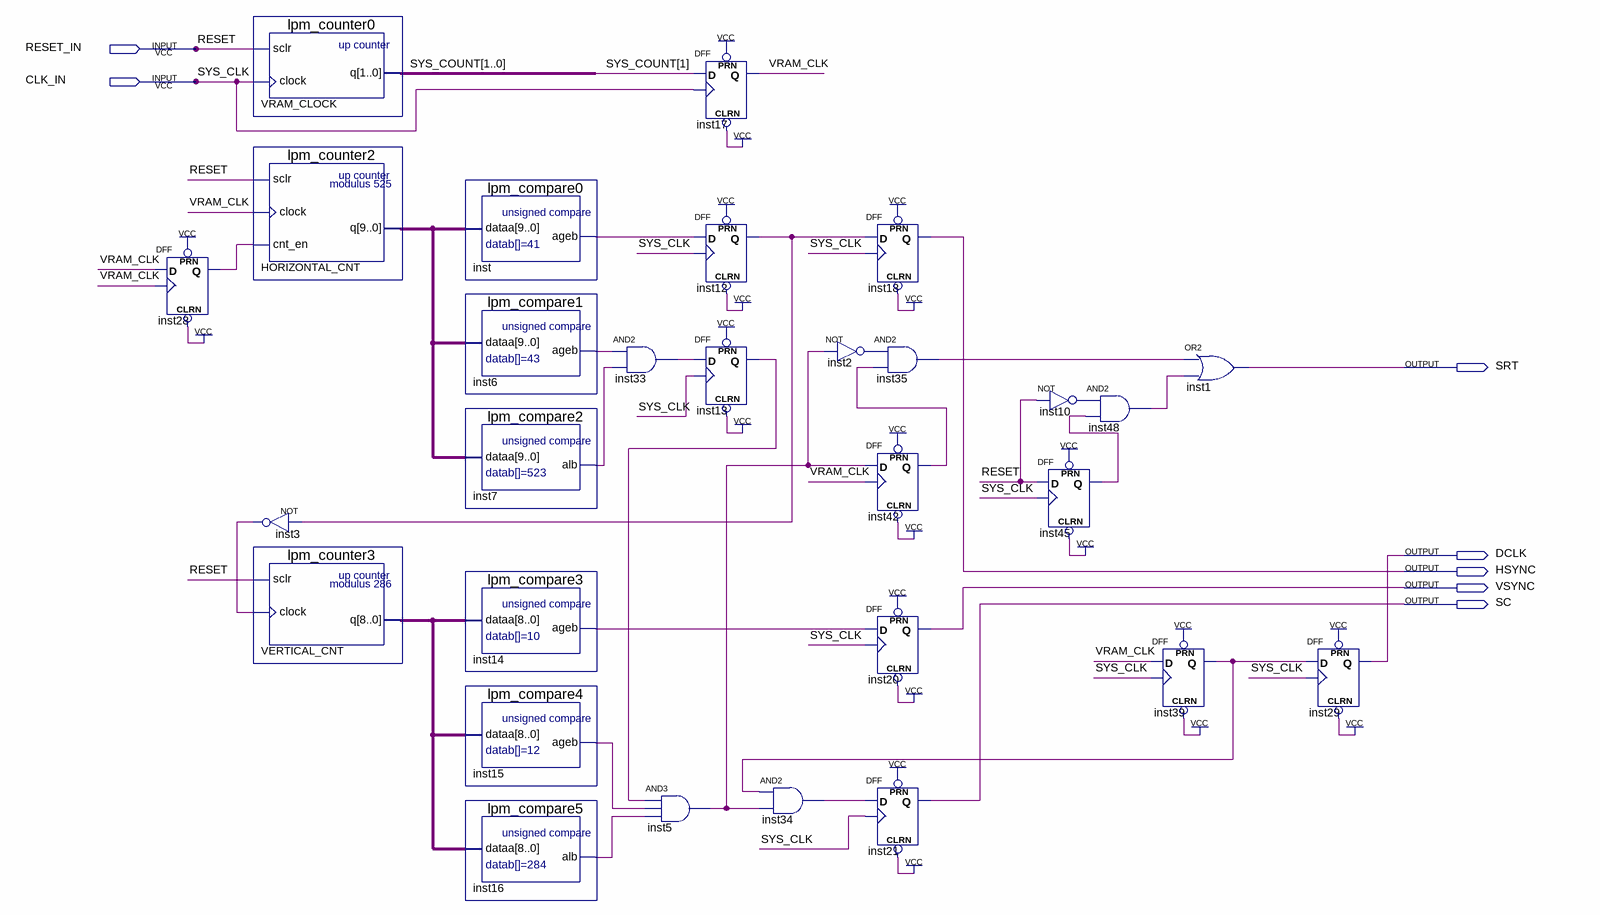
[diagram p0: schematic sheet]
// Quartus schematic oscilloscope-display-test.bdf as structural Verilog: 29 symbols, 7 pins
module \oscilloscope-display-test  (
  input  RESET_IN,
  input  CLK_IN,
  output SRT,
  output DCLK,
  output HSYNC,
  output VSYNC,
  output SC
);

  wire inst2_out, inst3_out, inst5_out, inst6_ageb, inst7_alb, inst10_out, inst12_q, inst13_q, inst14_ageb,
       inst15_ageb, inst16_alb, inst28_q, inst33_out, inst34_out, inst35_out, inst39_q, inst42_q, inst45_q,
       inst48_out, inst_ageb, VRAM_CLK;
  wire [1:0] SYS_COUNT;
  wire [8:0] VERTICAL_CNT_q;
  wire [9:0] HORIZONTAL_CNT_q;

  DFF inst28 (.CLRN(1'b1), .CLK(VRAM_CLK), .D(VRAM_CLK), .PRN(1'b1), .Q(inst28_q));
  lpm_counter0 VRAM_CLOCK (.sclr(RESET_IN), .clock(CLK_IN), .q(SYS_COUNT));
  lpm_counter2 HORIZONTAL_CNT (.sclr(RESET_IN), .clock(VRAM_CLK), .cnt_en(inst28_q), .q(HORIZONTAL_CNT_q));
  not inst3 (inst3_out, inst12_q);
  lpm_counter3 VERTICAL_CNT (.sclr(RESET_IN), .clock(inst3_out), .q(VERTICAL_CNT_q));
  lpm_compare0 inst (.dataa(HORIZONTAL_CNT_q), .ageb(inst_ageb));
  lpm_compare1 inst6 (.dataa(HORIZONTAL_CNT_q), .ageb(inst6_ageb));
  lpm_compare2 inst7 (.dataa(HORIZONTAL_CNT_q), .alb(inst7_alb));
  lpm_compare3 inst14 (.dataa(VERTICAL_CNT_q), .ageb(inst14_ageb));
  lpm_compare4 inst15 (.dataa(VERTICAL_CNT_q), .ageb(inst15_ageb));
  lpm_compare5 inst16 (.dataa(VERTICAL_CNT_q), .alb(inst16_alb));
  and inst33 (inst33_out, inst6_ageb, inst7_alb);
  and inst5 (inst5_out, inst13_q, inst15_ageb, inst16_alb);
  DFF inst17 (.CLRN(1'b1), .CLK(CLK_IN), .D(SYS_COUNT[1]), .PRN(1'b1), .Q(VRAM_CLK));
  DFF inst12 (.CLRN(1'b1), .CLK(CLK_IN), .D(inst_ageb), .PRN(1'b1), .Q(inst12_q));
  DFF inst13 (.CLRN(1'b1), .CLK(CLK_IN), .D(inst33_out), .PRN(1'b1), .Q(inst13_q));
  and inst34 (inst34_out, inst39_q, inst5_out);
  not inst2 (inst2_out, inst5_out);
  DFF inst18 (.CLRN(1'b1), .CLK(CLK_IN), .D(inst12_q), .PRN(1'b1), .Q(HSYNC));
  and inst35 (inst35_out, inst2_out, inst42_q);
  DFF inst42 (.CLRN(1'b1), .CLK(VRAM_CLK), .D(inst5_out), .PRN(1'b1), .Q(inst42_q));
  DFF inst20 (.CLRN(1'b1), .CLK(CLK_IN), .D(inst14_ageb), .PRN(1'b1), .Q(VSYNC));
  DFF inst21 (.CLRN(1'b1), .CLK(CLK_IN), .D(inst34_out), .PRN(1'b1), .Q(SC));
  not inst10 (inst10_out, RESET_IN);
  DFF inst45 (.CLRN(1'b1), .CLK(CLK_IN), .D(RESET_IN), .PRN(1'b1), .Q(inst45_q));
  and inst48 (inst48_out, inst10_out, inst45_q);
  or inst1 (SRT, inst35_out, inst48_out);
  DFF inst39 (.CLRN(1'b1), .CLK(CLK_IN), .D(VRAM_CLK), .PRN(1'b1), .Q(inst39_q));
  DFF inst29 (.CLRN(1'b1), .CLK(CLK_IN), .D(inst39_q), .PRN(1'b1), .Q(DCLK));

  // Other names for the same wires on the sheet: SYS_CLK = CLK_IN; RESET = RESET_IN
endmodule
